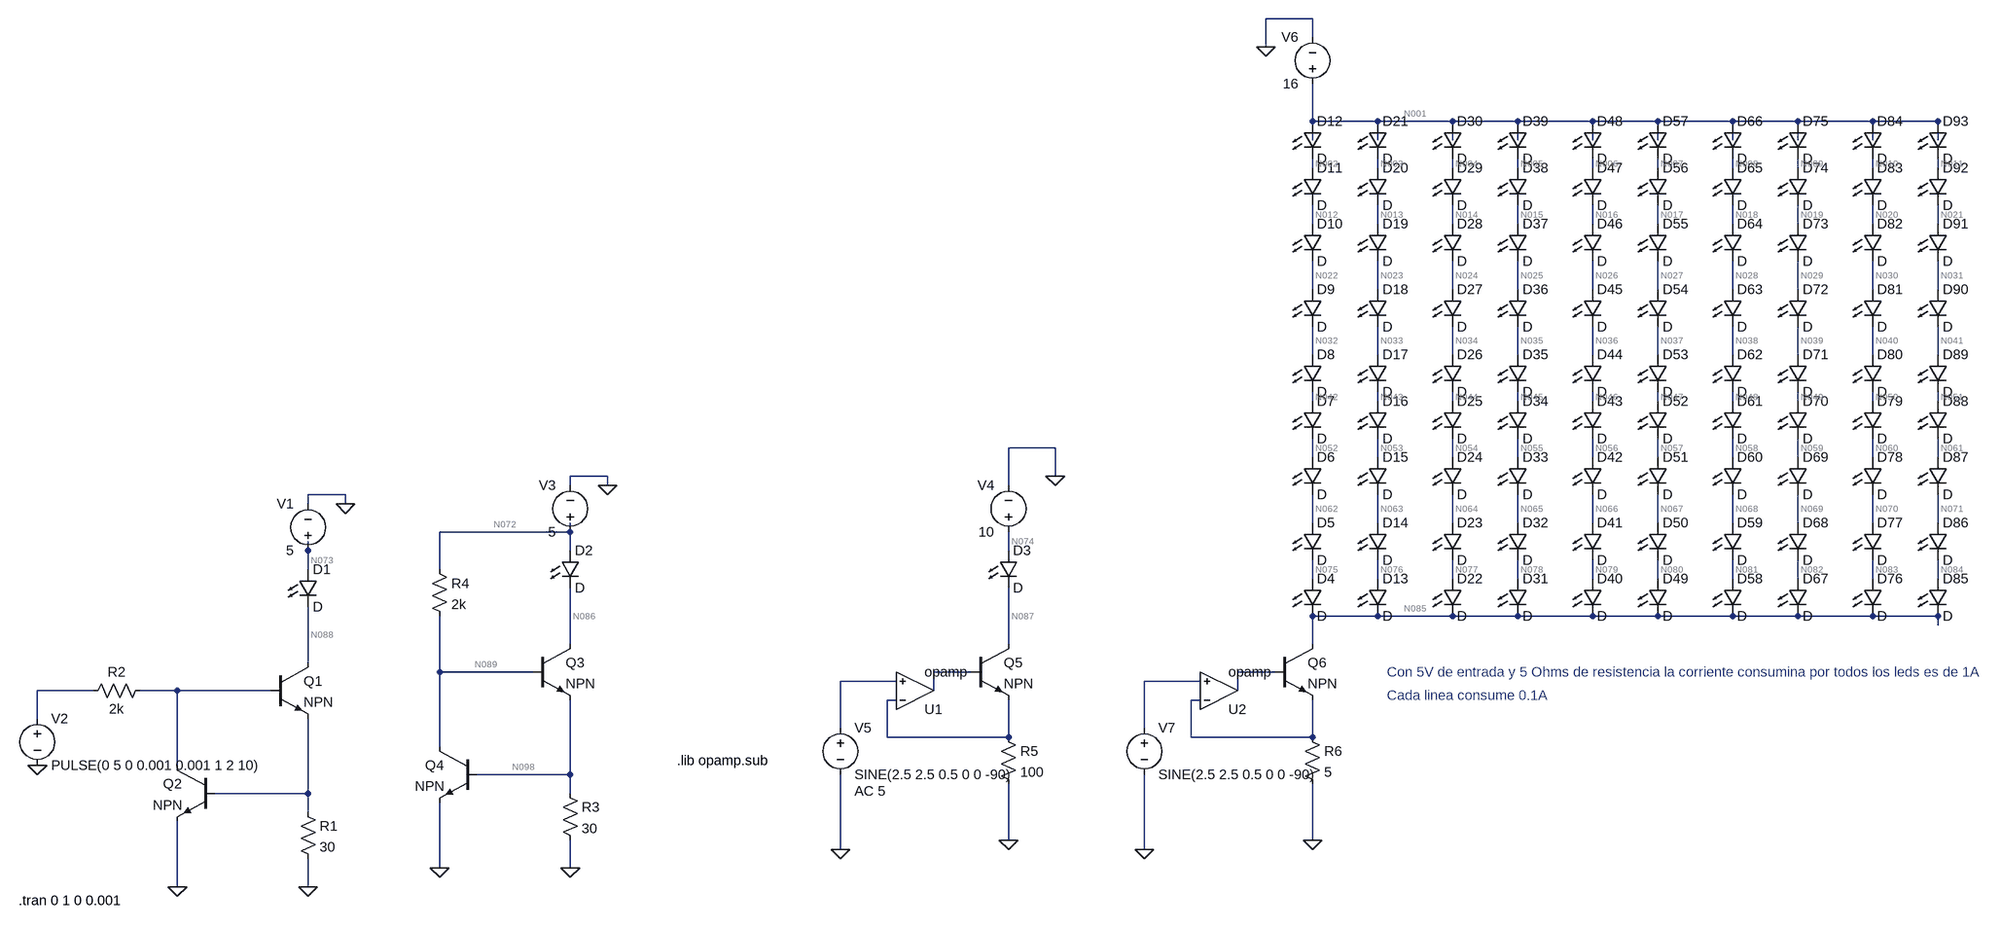
[diagram p0: schematic Modulo de corriente.asc]
Modulo de corriente.asc, the LTspice schematic file:
Version 4
SHEET 1 4360 724
WIRE 2960 -1056 2880 -1056
WIRE 2960 -1024 2960 -1056
WIRE 2880 -1008 2880 -1056
WIRE 2960 -880 2960 -944
WIRE 3072 -880 2960 -880
WIRE 3200 -880 3072 -880
WIRE 3312 -880 3200 -880
WIRE 3440 -880 3312 -880
WIRE 3552 -880 3440 -880
WIRE 3680 -880 3552 -880
WIRE 3792 -880 3680 -880
WIRE 3920 -880 3792 -880
WIRE 4032 -880 3920 -880
WIRE 2960 -848 2960 -880
WIRE 3072 -848 3072 -880
WIRE 3200 -848 3200 -880
WIRE 3312 -848 3312 -880
WIRE 3440 -848 3440 -880
WIRE 3552 -848 3552 -880
WIRE 3680 -848 3680 -880
WIRE 3792 -848 3792 -880
WIRE 3920 -848 3920 -880
WIRE 4032 -848 4032 -880
WIRE 2960 -800 2960 -816
WIRE 3072 -800 3072 -816
WIRE 3200 -800 3200 -816
WIRE 3312 -800 3312 -816
WIRE 3440 -800 3440 -816
WIRE 3552 -800 3552 -816
WIRE 3680 -800 3680 -816
WIRE 3792 -800 3792 -816
WIRE 3920 -800 3920 -816
WIRE 4032 -800 4032 -816
WIRE 2960 -704 2960 -736
WIRE 3072 -704 3072 -736
WIRE 3200 -704 3200 -736
WIRE 3312 -704 3312 -736
WIRE 3440 -704 3440 -736
WIRE 3552 -704 3552 -736
WIRE 3680 -704 3680 -736
WIRE 3792 -704 3792 -736
WIRE 3920 -704 3920 -736
WIRE 4032 -704 4032 -736
WIRE 2960 -592 2960 -640
WIRE 3072 -592 3072 -640
WIRE 3200 -592 3200 -640
WIRE 3312 -592 3312 -640
WIRE 3440 -592 3440 -640
WIRE 3552 -592 3552 -640
WIRE 3680 -592 3680 -640
WIRE 3792 -592 3792 -640
WIRE 3920 -592 3920 -640
WIRE 4032 -592 4032 -640
WIRE 2960 -480 2960 -528
WIRE 3072 -480 3072 -528
WIRE 3200 -480 3200 -528
WIRE 3312 -480 3312 -528
WIRE 3440 -480 3440 -528
WIRE 3552 -480 3552 -528
WIRE 3680 -480 3680 -528
WIRE 3792 -480 3792 -528
WIRE 3920 -480 3920 -528
WIRE 4032 -480 4032 -528
WIRE 2960 -400 2960 -416
WIRE 3072 -400 3072 -416
WIRE 3200 -400 3200 -416
WIRE 3312 -400 3312 -416
WIRE 3440 -400 3440 -416
WIRE 3552 -400 3552 -416
WIRE 3680 -400 3680 -416
WIRE 3792 -400 3792 -416
WIRE 3920 -400 3920 -416
WIRE 4032 -400 4032 -416
WIRE 2144 -320 2064 -320
WIRE 2960 -304 2960 -336
WIRE 3072 -304 3072 -336
WIRE 3200 -304 3200 -336
WIRE 3312 -304 3312 -336
WIRE 3440 -304 3440 -336
WIRE 3552 -304 3552 -336
WIRE 3680 -304 3680 -336
WIRE 3792 -304 3792 -336
WIRE 3920 -304 3920 -336
WIRE 4032 -304 4032 -336
WIRE 1232 -272 1168 -272
WIRE 2144 -272 2144 -320
WIRE 1168 -256 1168 -272
WIRE 1232 -256 1232 -272
WIRE 2064 -256 2064 -320
WIRE 336 -240 272 -240
WIRE 272 -224 272 -240
WIRE 336 -224 336 -240
WIRE 2960 -192 2960 -240
WIRE 3072 -192 3072 -240
WIRE 3200 -192 3200 -240
WIRE 3312 -192 3312 -240
WIRE 3440 -192 3440 -240
WIRE 3552 -192 3552 -240
WIRE 3680 -192 3680 -240
WIRE 3792 -192 3792 -240
WIRE 3920 -192 3920 -240
WIRE 4032 -192 4032 -240
WIRE 1168 -176 1168 -192
WIRE 1168 -176 944 -176
WIRE 272 -144 272 -160
WIRE 1168 -144 1168 -176
WIRE 2064 -144 2064 -176
WIRE 272 -112 272 -144
WIRE 944 -112 944 -176
WIRE 2960 -96 2960 -128
WIRE 3072 -96 3072 -128
WIRE 3200 -96 3200 -128
WIRE 3312 -96 3312 -128
WIRE 3440 -96 3440 -128
WIRE 3552 -96 3552 -128
WIRE 3680 -96 3680 -128
WIRE 3792 -96 3792 -128
WIRE 3920 -96 3920 -128
WIRE 4032 -96 4032 -128
WIRE 3072 -32 2960 -32
WIRE 3200 -32 3072 -32
WIRE 3312 -32 3200 -32
WIRE 3440 -32 3312 -32
WIRE 3552 -32 3440 -32
WIRE 3680 -32 3552 -32
WIRE 3792 -32 3680 -32
WIRE 3920 -32 3792 -32
WIRE 4032 -32 3920 -32
WIRE 4032 -16 4032 -32
WIRE 1168 16 1168 -80
WIRE 2064 16 2064 -80
WIRE 2960 16 2960 -32
WIRE 272 48 272 -48
WIRE 944 64 944 -32
WIRE 1104 64 944 64
WIRE 2000 64 1936 64
WIRE 2896 64 2832 64
WIRE 1872 80 1776 80
WIRE 2768 80 2672 80
WIRE -96 96 -192 96
WIRE 48 96 -16 96
WIRE 208 96 48 96
WIRE 1936 96 1936 64
WIRE 2832 96 2832 64
WIRE 1872 112 1856 112
WIRE 2768 112 2752 112
WIRE -192 144 -192 96
WIRE 1776 160 1776 80
WIRE 2672 160 2672 80
WIRE 1856 176 1856 112
WIRE 2064 176 2064 112
WIRE 2064 176 1856 176
WIRE 2752 176 2752 112
WIRE 2960 176 2960 112
WIRE 2960 176 2752 176
WIRE 944 192 944 64
WIRE 48 224 48 96
WIRE 1168 240 1168 112
WIRE 1168 240 1008 240
WIRE 272 272 272 144
WIRE 272 272 112 272
WIRE 1168 272 1168 240
WIRE 272 304 272 272
WIRE 2064 352 2064 256
WIRE 2960 352 2960 256
WIRE 1776 368 1776 240
WIRE 2672 368 2672 240
WIRE 944 400 944 288
WIRE 1168 400 1168 352
WIRE 48 432 48 320
WIRE 272 432 272 384
FLAG 336 -224 0
FLAG 48 432 0
FLAG 272 432 0
FLAG -192 224 0
FLAG 1232 -256 0
FLAG 944 400 0
FLAG 1168 400 0
FLAG 1776 368 0
FLAG 2064 352 0
FLAG 2144 -272 0
FLAG 2672 368 0
FLAG 2960 352 0
FLAG 2880 -1008 0
SYMBOL npn 208 48 R0
SYMATTR InstName Q1
SYMBOL npn 112 224 M0
SYMATTR InstName Q2
SYMBOL res 256 288 R0
SYMATTR InstName R1
SYMATTR Value 30
SYMBOL res 0 80 R90
WINDOW 0 0 56 VBottom 2
WINDOW 3 32 56 VTop 2
SYMATTR InstName R2
SYMATTR Value 2k
SYMBOL voltage 272 -128 R180
WINDOW 0 24 96 Left 2
WINDOW 3 24 16 Left 2
WINDOW 123 0 0 Left 2
WINDOW 39 0 0 Left 2
SYMATTR InstName V1
SYMATTR Value 5
SYMBOL LED 256 -112 R0
SYMATTR InstName D1
SYMBOL voltage -192 128 R0
WINDOW 123 0 0 Left 2
WINDOW 39 0 0 Left 2
SYMATTR InstName V2
SYMATTR Value PULSE(0 5 0 0.001 0.001 1 2 10)
SYMBOL npn 1104 16 R0
SYMATTR InstName Q3
SYMBOL npn 1008 192 M0
SYMATTR InstName Q4
SYMBOL res 1152 256 R0
SYMATTR InstName R3
SYMATTR Value 30
SYMBOL voltage 1168 -160 R180
WINDOW 0 24 96 Left 2
WINDOW 3 24 16 Left 2
WINDOW 123 0 0 Left 2
WINDOW 39 0 0 Left 2
SYMATTR InstName V3
SYMATTR Value 5
SYMBOL LED 1152 -144 R0
SYMATTR InstName D2
SYMBOL res 928 -128 R0
SYMATTR InstName R4
SYMATTR Value 2k
SYMBOL LED 2048 -144 R0
SYMATTR InstName D3
SYMBOL OpAmps\\opamp 1904 160 M180
SYMATTR InstName U1
SYMBOL res 2048 160 R0
SYMATTR InstName R5
SYMATTR Value 100
SYMBOL voltage 2064 -160 R180
WINDOW 0 24 96 Left 2
WINDOW 3 24 16 Left 2
WINDOW 123 0 0 Left 2
WINDOW 39 0 0 Left 2
SYMATTR InstName V4
SYMATTR Value 10
SYMBOL voltage 1776 144 R0
WINDOW 123 24 124 Left 2
WINDOW 39 0 0 Left 2
SYMATTR Value2 AC 5
SYMATTR InstName V5
SYMATTR Value SINE(2.5 2.5 0.5 0 0 -90)
SYMBOL npn 2000 16 R0
SYMATTR InstName Q5
SYMBOL LED 2944 -96 R0
SYMATTR InstName D4
SYMBOL OpAmps\\opamp 2800 160 M180
SYMATTR InstName U2
SYMBOL res 2944 160 R0
SYMATTR InstName R6
SYMATTR Value 5
SYMBOL voltage 2672 144 R0
WINDOW 123 24 124 Left 2
WINDOW 39 0 0 Left 2
SYMATTR InstName V7
SYMATTR Value SINE(2.5 2.5 0.5 0 0 -90)
SYMBOL npn 2896 16 R0
SYMATTR InstName Q6
SYMBOL LED 2944 -192 R0
SYMATTR InstName D5
SYMBOL LED 2944 -304 R0
SYMATTR InstName D6
SYMBOL LED 2944 -400 R0
SYMATTR InstName D7
SYMBOL LED 2944 -480 R0
SYMATTR InstName D8
SYMBOL LED 2944 -592 R0
SYMATTR InstName D9
SYMBOL LED 2944 -704 R0
SYMATTR InstName D10
SYMBOL LED 2944 -800 R0
SYMATTR InstName D11
SYMBOL LED 2944 -880 R0
SYMATTR InstName D12
SYMBOL LED 3056 -96 R0
SYMATTR InstName D13
SYMBOL LED 3056 -192 R0
SYMATTR InstName D14
SYMBOL LED 3056 -304 R0
SYMATTR InstName D15
SYMBOL LED 3056 -400 R0
SYMATTR InstName D16
SYMBOL LED 3056 -480 R0
SYMATTR InstName D17
SYMBOL LED 3056 -592 R0
SYMATTR InstName D18
SYMBOL LED 3056 -704 R0
SYMATTR InstName D19
SYMBOL LED 3056 -800 R0
SYMATTR InstName D20
SYMBOL LED 3056 -880 R0
SYMATTR InstName D21
SYMBOL LED 3184 -96 R0
SYMATTR InstName D22
SYMBOL LED 3184 -192 R0
SYMATTR InstName D23
SYMBOL LED 3184 -304 R0
SYMATTR InstName D24
SYMBOL LED 3184 -400 R0
SYMATTR InstName D25
SYMBOL LED 3184 -480 R0
SYMATTR InstName D26
SYMBOL LED 3184 -592 R0
SYMATTR InstName D27
SYMBOL LED 3184 -704 R0
SYMATTR InstName D28
SYMBOL LED 3184 -800 R0
SYMATTR InstName D29
SYMBOL LED 3184 -880 R0
SYMATTR InstName D30
SYMBOL LED 3296 -96 R0
SYMATTR InstName D31
SYMBOL LED 3296 -192 R0
SYMATTR InstName D32
SYMBOL LED 3296 -304 R0
SYMATTR InstName D33
SYMBOL LED 3296 -400 R0
SYMATTR InstName D34
SYMBOL LED 3296 -480 R0
SYMATTR InstName D35
SYMBOL LED 3296 -592 R0
SYMATTR InstName D36
SYMBOL LED 3296 -704 R0
SYMATTR InstName D37
SYMBOL LED 3296 -800 R0
SYMATTR InstName D38
SYMBOL LED 3296 -880 R0
SYMATTR InstName D39
SYMBOL LED 3424 -96 R0
SYMATTR InstName D40
SYMBOL LED 3424 -192 R0
SYMATTR InstName D41
SYMBOL LED 3424 -304 R0
SYMATTR InstName D42
SYMBOL LED 3424 -400 R0
SYMATTR InstName D43
SYMBOL LED 3424 -480 R0
SYMATTR InstName D44
SYMBOL LED 3424 -592 R0
SYMATTR InstName D45
SYMBOL LED 3424 -704 R0
SYMATTR InstName D46
SYMBOL LED 3424 -800 R0
SYMATTR InstName D47
SYMBOL LED 3424 -880 R0
SYMATTR InstName D48
SYMBOL LED 3536 -96 R0
SYMATTR InstName D49
SYMBOL LED 3536 -192 R0
SYMATTR InstName D50
SYMBOL LED 3536 -304 R0
SYMATTR InstName D51
SYMBOL LED 3536 -400 R0
SYMATTR InstName D52
SYMBOL LED 3536 -480 R0
SYMATTR InstName D53
SYMBOL LED 3536 -592 R0
SYMATTR InstName D54
SYMBOL LED 3536 -704 R0
SYMATTR InstName D55
SYMBOL LED 3536 -800 R0
SYMATTR InstName D56
SYMBOL LED 3536 -880 R0
SYMATTR InstName D57
SYMBOL LED 3664 -96 R0
SYMATTR InstName D58
SYMBOL LED 3664 -192 R0
SYMATTR InstName D59
SYMBOL LED 3664 -304 R0
SYMATTR InstName D60
SYMBOL LED 3664 -400 R0
SYMATTR InstName D61
SYMBOL LED 3664 -480 R0
SYMATTR InstName D62
SYMBOL LED 3664 -592 R0
SYMATTR InstName D63
SYMBOL LED 3664 -704 R0
SYMATTR InstName D64
SYMBOL LED 3664 -800 R0
SYMATTR InstName D65
SYMBOL LED 3664 -880 R0
SYMATTR InstName D66
SYMBOL LED 3776 -96 R0
SYMATTR InstName D67
SYMBOL LED 3776 -192 R0
SYMATTR InstName D68
SYMBOL LED 3776 -304 R0
SYMATTR InstName D69
SYMBOL LED 3776 -400 R0
SYMATTR InstName D70
SYMBOL LED 3776 -480 R0
SYMATTR InstName D71
SYMBOL LED 3776 -592 R0
SYMATTR InstName D72
SYMBOL LED 3776 -704 R0
SYMATTR InstName D73
SYMBOL LED 3776 -800 R0
SYMATTR InstName D74
SYMBOL LED 3776 -880 R0
SYMATTR InstName D75
SYMBOL LED 3904 -96 R0
SYMATTR InstName D76
SYMBOL LED 3904 -192 R0
SYMATTR InstName D77
SYMBOL LED 3904 -304 R0
SYMATTR InstName D78
SYMBOL LED 3904 -400 R0
SYMATTR InstName D79
SYMBOL LED 3904 -480 R0
SYMATTR InstName D80
SYMBOL LED 3904 -592 R0
SYMATTR InstName D81
SYMBOL LED 3904 -704 R0
SYMATTR InstName D82
SYMBOL LED 3904 -800 R0
SYMATTR InstName D83
SYMBOL LED 3904 -880 R0
SYMATTR InstName D84
SYMBOL LED 4016 -96 R0
SYMATTR InstName D85
SYMBOL LED 4016 -192 R0
SYMATTR InstName D86
SYMBOL LED 4016 -304 R0
SYMATTR InstName D87
SYMBOL LED 4016 -400 R0
SYMATTR InstName D88
SYMBOL LED 4016 -480 R0
SYMATTR InstName D89
SYMBOL LED 4016 -592 R0
SYMATTR InstName D90
SYMBOL LED 4016 -704 R0
SYMATTR InstName D91
SYMBOL LED 4016 -800 R0
SYMATTR InstName D92
SYMBOL LED 4016 -880 R0
SYMATTR InstName D93
SYMBOL voltage 2960 -928 R180
WINDOW 0 24 96 Left 2
WINDOW 3 24 16 Left 2
WINDOW 123 0 0 Left 2
WINDOW 39 0 0 Left 2
SYMATTR InstName V6
SYMATTR Value 16
TEXT -224 456 Left 2 !.tran 0 1 0 0.001
TEXT 1496 216 Left 2 !.lib opamp.sub
TEXT 3088 64 Left 2 ;Con 5V de entrada y 5 Ohms de resistencia la corriente consumina por todos los leds es de 1A
TEXT 3088 104 Left 2 ;Cada linea consume 0.1A

The netlist it stands for:
* Modulo de corriente.asc
Q1 N088 N095 N099 0 NPN
Q2 N095 N099 0 0 NPN
R1 N099 0 30
R2 N095 N094 2k
V1 N073 0 5
D1 N073 N088 D
V2 N094 0 PULSE(0 5 0 0.001 0.001 1 2 10)
Q3 N086 N089 N098 0 NPN
Q4 N089 N098 0 0 NPN
R3 N098 0 30
V3 N072 0 5
D2 N072 N086 D
R4 N072 N089 2k
D3 N074 N087 D
XU1 N096 N092 N090 opamp Aol=100K GBW=10Meg  ; pins invin noninvin out
R5 N096 0 100
V4 N074 0 10
V5 N092 0 SINE(2.5 2.5 0.5 0 0 -90) AC 5
Q5 N087 N090 N096 0 NPN
D4 N075 N085 D
XU2 N097 N093 N091 opamp Aol=100K GBW=10Meg  ; pins invin noninvin out
R6 N097 0 5
V7 N093 0 SINE(2.5 2.5 0.5 0 0 -90)
Q6 N085 N091 N097 0 NPN
D5 N062 N075 D
D6 N052 N062 D
D7 N042 N052 D
D8 N032 N042 D
D9 N022 N032 D
D10 N012 N022 D
D11 N002 N012 D
D12 N001 N002 D
D13 N076 N085 D
D14 N063 N076 D
D15 N053 N063 D
D16 N043 N053 D
D17 N033 N043 D
D18 N023 N033 D
D19 N013 N023 D
D20 N003 N013 D
D21 N001 N003 D
D22 N077 N085 D
D23 N064 N077 D
D24 N054 N064 D
D25 N044 N054 D
D26 N034 N044 D
D27 N024 N034 D
D28 N014 N024 D
D29 N004 N014 D
D30 N001 N004 D
D31 N078 N085 D
D32 N065 N078 D
D33 N055 N065 D
D34 N045 N055 D
D35 N035 N045 D
D36 N025 N035 D
D37 N015 N025 D
D38 N005 N015 D
D39 N001 N005 D
D40 N079 N085 D
D41 N066 N079 D
D42 N056 N066 D
D43 N046 N056 D
D44 N036 N046 D
D45 N026 N036 D
D46 N016 N026 D
D47 N006 N016 D
D48 N001 N006 D
D49 N080 N085 D
D50 N067 N080 D
D51 N057 N067 D
D52 N047 N057 D
D53 N037 N047 D
D54 N027 N037 D
D55 N017 N027 D
D56 N007 N017 D
D57 N001 N007 D
D58 N081 N085 D
D59 N068 N081 D
D60 N058 N068 D
D61 N048 N058 D
D62 N038 N048 D
D63 N028 N038 D
D64 N018 N028 D
D65 N008 N018 D
D66 N001 N008 D
D67 N082 N085 D
D68 N069 N082 D
D69 N059 N069 D
D70 N049 N059 D
D71 N039 N049 D
D72 N029 N039 D
D73 N019 N029 D
D74 N009 N019 D
D75 N001 N009 D
D76 N083 N085 D
D77 N070 N083 D
D78 N060 N070 D
D79 N050 N060 D
D80 N040 N050 D
D81 N030 N040 D
D82 N020 N030 D
D83 N010 N020 D
D84 N001 N010 D
D85 N084 N085 D
D86 N071 N084 D
D87 N061 N071 D
D88 N051 N061 D
D89 N041 N051 D
D90 N031 N041 D
D91 N021 N031 D
D92 N011 N021 D
D93 N001 N011 D
V6 N001 0 16
.model D D
.lib standard.dio
.model NPN NPN
.model PNP PNP
.lib standard.bjt
.tran 0 1 0 0.001
.lib opamp.sub
* Con 5V de entrada y 5 Ohms de resistencia la corriente consumina por todos los leds es de 1A
* Cada linea consume 0.1A
.backanno
.end

* Results of the author's LTspice run, read from the files saved beside the schematic
* Operating Point, zero values left out:
*   V(n088) = 4.841 V
*   V(n073) = 5 V
*   V(n086) = 4.261 V
*   V(n089) = 1.642 V
*   V(n098) = 783.3 mV
*   V(n072) = 5 V
*   V(n074) = 10 V
*   V(n087) = 9.822 V
*   V(n075) = 14.98 V
*   V(n085) = 14.85 V
*   V(n062) = 15.11 V
*   V(n052) = 15.24 V
*   V(n042) = 15.36 V
*   V(n032) = 15.49 V
*   V(n022) = 15.62 V
*   V(n012) = 15.75 V
*   V(n002) = 15.87 V
*   V(n001) = 16 V
*   V(n076) = 14.98 V
*   V(n063) = 15.11 V
*   V(n053) = 15.24 V
*   V(n043) = 15.36 V
*   V(n033) = 15.49 V
*   V(n023) = 15.62 V
*   V(n013) = 15.75 V
*   V(n003) = 15.87 V
*   V(n077) = 14.98 V
*   V(n064) = 15.11 V
*   V(n054) = 15.24 V
*   V(n044) = 15.36 V
*   V(n034) = 15.49 V
*   V(n024) = 15.62 V
*   V(n014) = 15.75 V
*   V(n004) = 15.87 V
*   V(n078) = 14.98 V
*   V(n065) = 15.11 V
*   V(n055) = 15.24 V
*   V(n045) = 15.36 V
*   V(n035) = 15.49 V
*   V(n025) = 15.62 V
*   V(n015) = 15.75 V
*   V(n005) = 15.87 V
*   V(n079) = 14.98 V
*   V(n066) = 15.11 V
*   V(n056) = 15.24 V
*   V(n046) = 15.36 V
*   V(n036) = 15.49 V
*   V(n026) = 15.62 V
*   V(n016) = 15.75 V
*   V(n006) = 15.87 V
*   V(n080) = 14.98 V
*   V(n067) = 15.11 V
*   V(n057) = 15.24 V
*   V(n047) = 15.36 V
*   V(n037) = 15.49 V
*   V(n027) = 15.62 V
*   V(n017) = 15.75 V
*   V(n007) = 15.87 V
*   V(n081) = 14.98 V
*   V(n068) = 15.11 V
*   V(n058) = 15.24 V
*   V(n048) = 15.36 V
*   V(n038) = 15.49 V
*   V(n028) = 15.62 V
*   V(n018) = 15.75 V
*   V(n008) = 15.87 V
*   V(n082) = 14.98 V
*   V(n069) = 15.11 V
*   V(n059) = 15.24 V
*   V(n049) = 15.36 V
*   V(n039) = 15.49 V
*   V(n029) = 15.62 V
*   V(n019) = 15.75 V
*   V(n009) = 15.87 V
*   V(n083) = 14.98 V
*   V(n070) = 15.11 V
*   V(n060) = 15.24 V
*   V(n050) = 15.36 V
*   V(n040) = 15.49 V
*   V(n030) = 15.62 V
*   V(n020) = 15.75 V
*   V(n010) = 15.87 V
*   V(n084) = 14.98 V
*   V(n071) = 15.11 V
*   V(n061) = 15.24 V
*   V(n051) = 15.36 V
*   V(n041) = 15.49 V
*   V(n031) = 15.62 V
*   V(n021) = 15.75 V
*   V(n011) = 15.87 V
*   Ic(Q6) = 14.86 pA
*   Ib(Q6) = -14.86 pA
*   Ic(Q5) = 9.822 pA
*   Ib(Q5) = -9.822 pA
*   Ic(Q4) = 1.421 mA
*   Ib(Q4) = 14.21 µA
*   Ie(Q4) = -1.435 mA
*   Ic(Q3) = 25.87 mA
*   Ib(Q3) = 258.7 µA
*   Ie(Q3) = -26.12 mA
*   Ic(Q1) = 4.841 pA
*   Ib(Q1) = -4.841 pA
*   I(D93) = 1.486 pA
*   I(D92) = 1.486 pA
*   I(D91) = 1.486 pA
*   I(D90) = 1.486 pA
*   I(D89) = 1.486 pA
*   I(D88) = 1.486 pA
*   I(D87) = 1.486 pA
*   I(D86) = 1.486 pA
*   I(D85) = 1.486 pA
*   I(D84) = 1.486 pA
*   I(D83) = 1.486 pA
*   I(D82) = 1.486 pA
*   I(D81) = 1.486 pA
*   I(D80) = 1.486 pA
*   I(D79) = 1.486 pA
*   I(D78) = 1.486 pA
*   I(D77) = 1.486 pA
*   I(D76) = 1.486 pA
*   I(D75) = 1.486 pA
*   I(D74) = 1.486 pA
*   I(D73) = 1.486 pA
*   I(D72) = 1.486 pA
*   I(D71) = 1.486 pA
*   I(D70) = 1.486 pA
*   I(D69) = 1.486 pA
*   I(D68) = 1.486 pA
*   I(D67) = 1.486 pA
*   I(D66) = 1.486 pA
*   I(D65) = 1.486 pA
*   I(D64) = 1.486 pA
*   I(D63) = 1.486 pA
*   I(D62) = 1.486 pA
*   I(D61) = 1.486 pA
*   I(D60) = 1.486 pA
*   I(D59) = 1.486 pA
*   I(D58) = 1.486 pA
*   I(D57) = 1.486 pA
*   I(D56) = 1.486 pA
*   I(D55) = 1.486 pA
*   I(D54) = 1.486 pA
*   I(D53) = 1.486 pA
*   I(D52) = 1.486 pA
*   I(D51) = 1.486 pA
*   I(D50) = 1.486 pA
*   I(D49) = 1.486 pA
*   I(D48) = 1.486 pA
*   I(D47) = 1.486 pA
*   I(D46) = 1.486 pA
*   I(D45) = 1.486 pA
*   I(D44) = 1.486 pA
*   I(D43) = 1.486 pA
*   I(D42) = 1.486 pA
*   I(D41) = 1.486 pA
*   I(D40) = 1.486 pA
*   I(D39) = 1.486 pA
*   I(D38) = 1.486 pA
*   I(D37) = 1.486 pA
*   I(D36) = 1.486 pA
*   I(D35) = 1.486 pA
*   I(D34) = 1.486 pA
*   I(D33) = 1.486 pA
*   I(D32) = 1.486 pA
*   I(D31) = 1.486 pA
*   I(D30) = 1.486 pA
*   I(D29) = 1.486 pA
*   I(D28) = 1.486 pA
*   I(D27) = 1.486 pA
*   I(D26) = 1.486 pA
*   I(D25) = 1.486 pA
*   I(D24) = 1.486 pA
*   I(D23) = 1.486 pA
*   I(D22) = 1.486 pA
*   I(D21) = 1.486 pA
*   I(D20) = 1.486 pA
*   I(D19) = 1.486 pA
*   I(D18) = 1.486 pA
*   I(D17) = 1.486 pA
*   I(D16) = 1.486 pA
*   I(D15) = 1.486 pA
*   I(D14) = 1.486 pA
*   I(D13) = 1.486 pA
*   I(D12) = 1.486 pA
*   I(D11) = 1.486 pA
*   I(D10) = 1.486 pA
*   I(D9) = 1.486 pA
*   I(D8) = 1.486 pA
*   I(D7) = 1.486 pA
*   I(D6) = 1.486 pA
*   I(D5) = 1.486 pA
*   I(D4) = 1.486 pA
*   I(D3) = 9.93 pA
*   I(D2) = 25.87 mA
*   I(D1) = 4.841 pA
*   I(R4) = 1.679 mA
*   I(R3) = 26.11 mA
*   I(R2) = 4.841 pA
*   I(V6) = -14.86 pA
*   I(V4) = -9.822 pA
*   I(V3) = -27.55 mA
*   I(V2) = 4.841 pA
*   I(V1) = -4.841 pA
*   Ix(u1:3) = 9.822 pA
*   Ix(u2:3) = 14.86 pA
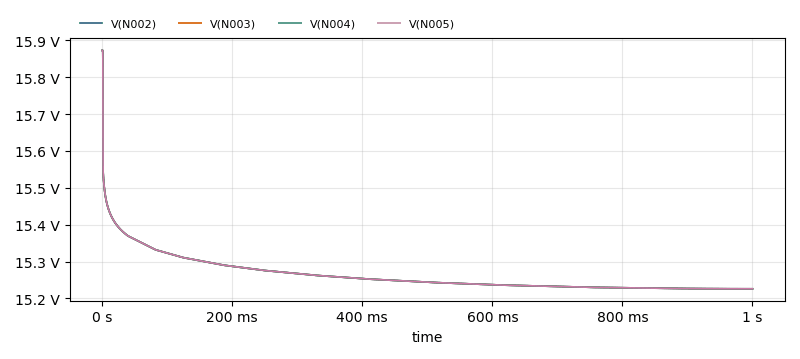
[diagram p1: Transient Analysis of Modulo de corriente.asc, plotted from the saved traces]
* Transient Analysis, 1 run:
*   V(N002): min 15.23 V, max 15.87 V, average 15.26 V, rms 15.26 V, last 15.23 V
*   V(N003): min 15.23 V, max 15.87 V, average 15.26 V, rms 15.26 V, last 15.23 V
*   V(N004): min 15.23 V, max 15.87 V, average 15.26 V, rms 15.26 V, last 15.23 V
*   V(N005): min 15.23 V, max 15.87 V, average 15.26 V, rms 15.26 V, last 15.23 V